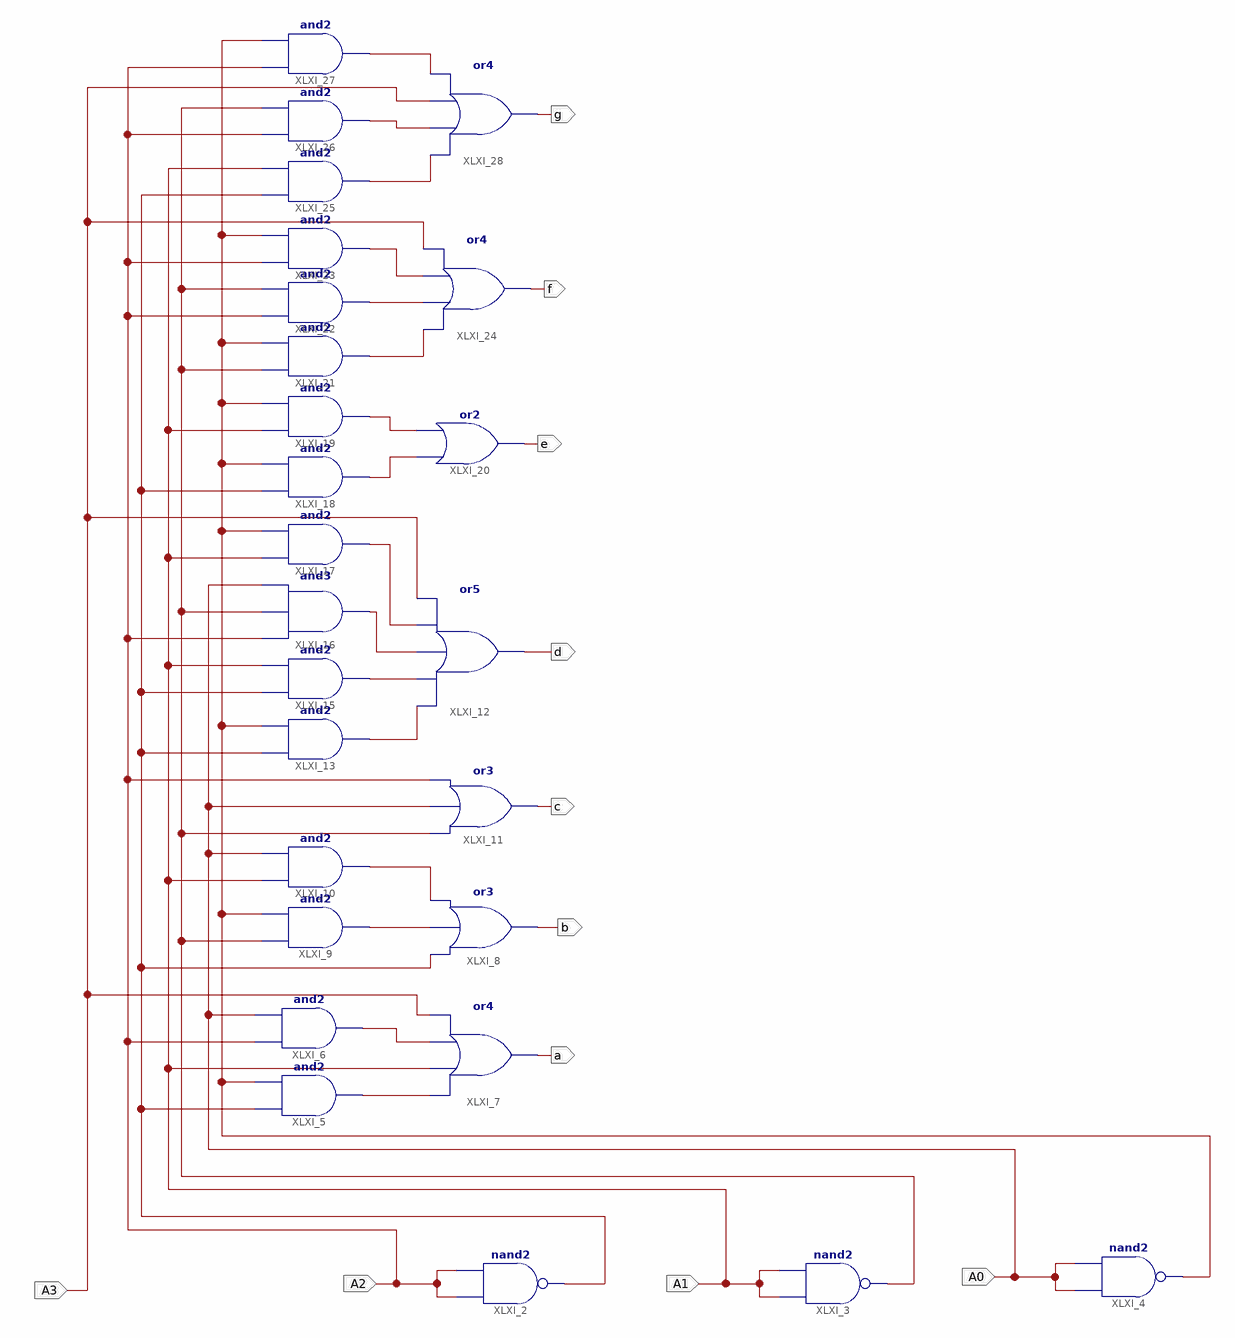
[diagram p0: schematic sheet 1]
// Xilinx ISE schematic decoder.sch (spartan6) as structural Verilog: 26 symbols, 11 ports
module decoder (
  input  A3,
  input  A2,
  input  A1,
  input  A0,
  output a,
  output b,
  output c,
  output d,
  output e,
  output f,
  output g
);

  wire XLXN_7, XLXN_10, XLXN_13, XLXN_14, XLXN_15, XLXN_19, XLXN_20, XLXN_32, XLXN_33, XLXN_34, XLXN_37,
       XLXN_40, XLXN_41, XLXN_44, XLXN_45, XLXN_46, XLXN_48, XLXN_49, XLXN_50;

  nand XLXI_2 (XLXN_7, A2, A2);
  nand XLXI_3 (XLXN_10, A1, A1);
  nand XLXI_4 (XLXN_13, A0, A0);
  and XLXI_5 (XLXN_14, XLXN_7, XLXN_13);
  and XLXI_6 (XLXN_15, A2, A0);
  or XLXI_7 (a, XLXN_14, A1, XLXN_15, A3);
  or XLXI_8 (b, XLXN_7, XLXN_19, XLXN_20);
  and XLXI_9 (XLXN_19, XLXN_10, XLXN_13);
  and XLXI_10 (XLXN_20, A1, A0);
  or XLXI_11 (c, XLXN_10, A0, A2);
  and XLXI_13 (XLXN_32, XLXN_7, XLXN_13);
  or XLXI_12 (d, XLXN_32, XLXN_33, XLXN_34, XLXN_37, A3);
  and XLXI_15 (XLXN_33, XLXN_7, A1);
  and XLXI_16 (XLXN_34, A2, XLXN_10, A0);
  and XLXI_17 (XLXN_37, A1, XLXN_13);
  and XLXI_18 (XLXN_41, XLXN_7, XLXN_13);
  and XLXI_19 (XLXN_40, A1, XLXN_13);
  or XLXI_20 (e, XLXN_41, XLXN_40);
  and XLXI_21 (XLXN_44, XLXN_10, XLXN_13);
  and XLXI_22 (XLXN_45, A2, XLXN_10);
  and XLXI_23 (XLXN_46, A2, XLXN_13);
  or XLXI_24 (f, XLXN_44, XLXN_45, XLXN_46, A3);
  and XLXI_25 (XLXN_50, XLXN_7, A1);
  and XLXI_26 (XLXN_49, A2, XLXN_10);
  and XLXI_27 (XLXN_48, A2, XLXN_13);
  or XLXI_28 (g, XLXN_50, XLXN_49, A3, XLXN_48);
endmodule
